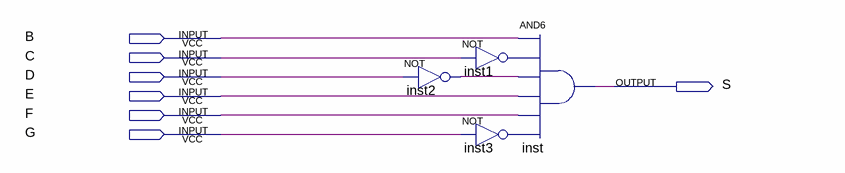
[diagram p0: schematic sheet]
// Quartus schematic Block6.bdf as structural Verilog: 4 symbols, 7 pins
module Block6 (
  input  B,
  input  C,
  input  D,
  input  E,
  input  F,
  input  G,
  output S
);

  wire inst1_out, inst2_out, inst3_out;

  not inst2 (inst2_out, D);
  not inst1 (inst1_out, C);
  not inst3 (inst3_out, G);
  and inst (S, B, inst1_out, inst2_out, E, F, inst3_out);
endmodule
